# Altium project UZ_CarrierBoard.PrjPcb (part 5 of 10)

## Sheet J3-3xGTHCLK+1xPLLCLK+MIO+B47+B48.SchDoc
size A4; Author: AG / EA / MG; CompanyName: Technische Hochschule Nürnberg Georg Simon Ohm; Organization: UltraZohm; Address1: Kesslerplatz 12; Address2: 90489 Nürnberg; Address3: GERMANY; SheetNumber: 6; Website: www.ultrazohm.com
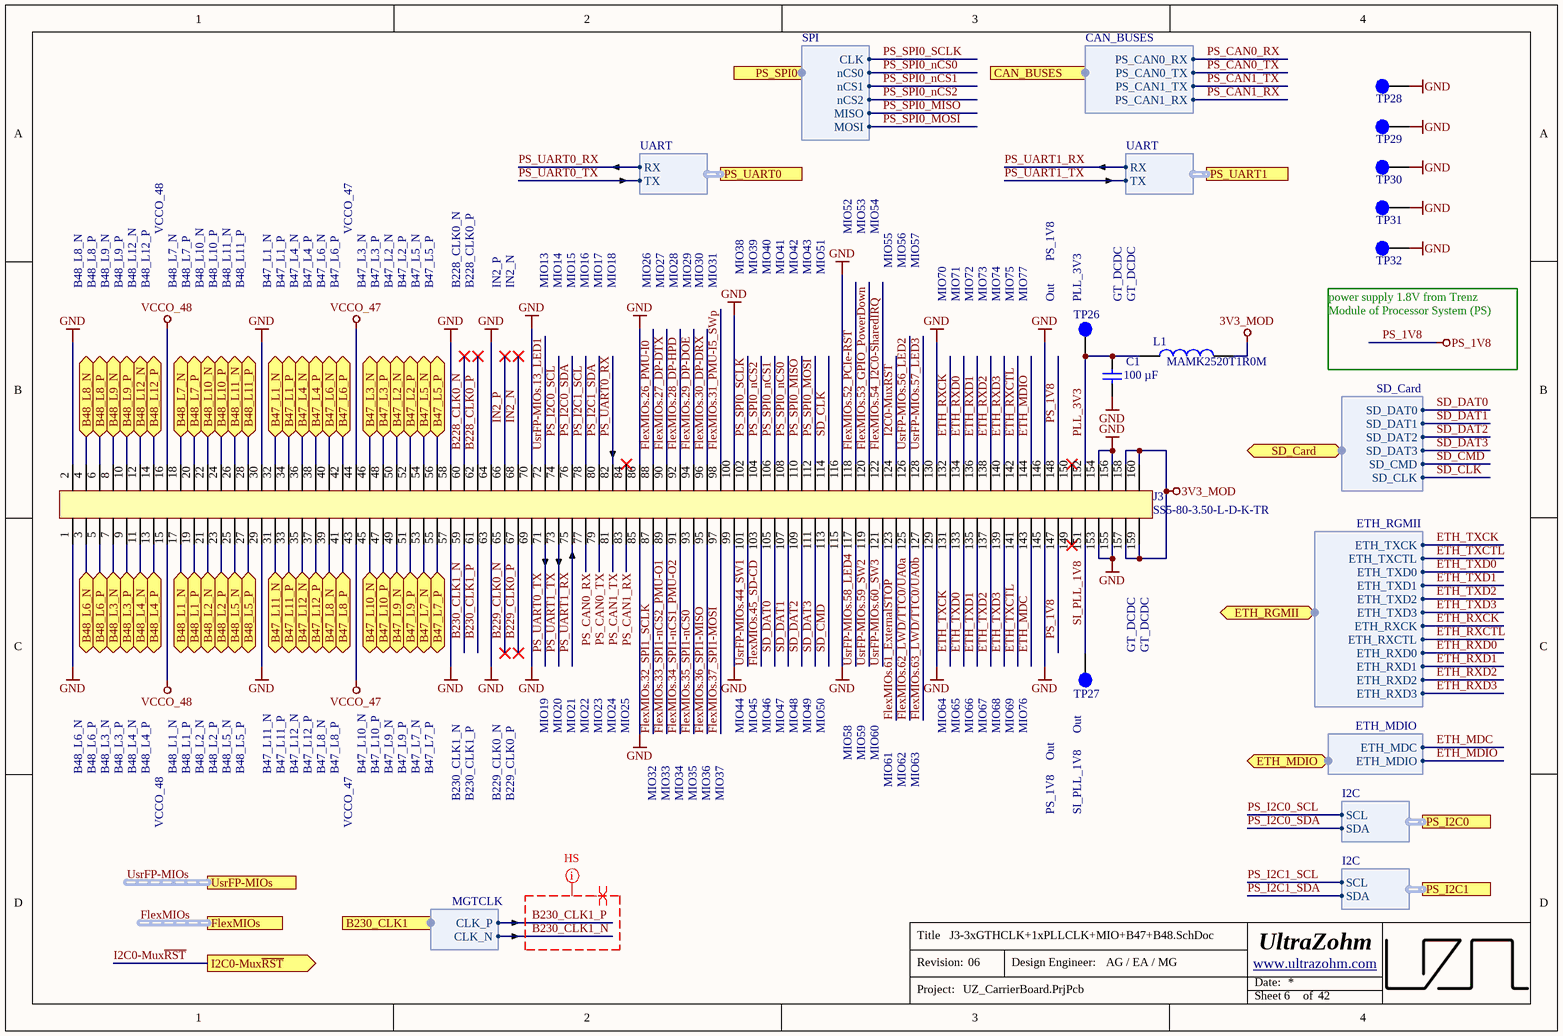
[diagram p13: J3-3xGTHCLK+1xPLLCLK+MIO+B47+B48.SchDoc]

### Parts
C1  100 µF  [C_1206_TE]
J3  SS5-80-3.50-L-D-K-TR  [SS5-80-3.50-L-D-K-TR]
L1  MAMK2520T1R0M  [INDC2520X120N]
TP26  Testpoint 1mm  [TP_1mm]  (value not drawn)  (no BOM)
TP27  Testpoint 1mm  [TP_1mm]  (value not drawn)  (no BOM)
TP28  Testpoint 1mm  [TP_1mm]  (value not drawn)  (no BOM)
TP29  Testpoint 1mm  [TP_1mm]  (value not drawn)  (no BOM)
TP30  Testpoint 1mm  [TP_1mm]  (value not drawn)  (no BOM)
TP31  Testpoint 1mm  [TP_1mm]  (value not drawn)  (no BOM)
TP32  Testpoint 1mm  [TP_1mm]  (value not drawn)  (no BOM)

### Ports
B47_L1_N (bidir), B47_L1_P (bidir), B47_L2_N (bidir), B47_L2_P (bidir), B47_L3_N (bidir), B47_L3_P (bidir), B47_L4_N (bidir), B47_L4_P (bidir), B47_L5_N (bidir), B47_L5_P (bidir), B47_L6_N (bidir), B47_L6_P (bidir), B47_L7_N (bidir), B47_L7_P (bidir), B47_L8_N (bidir), B47_L8_P (bidir), B47_L9_N (bidir), B47_L9_P (bidir), B47_L10_N (bidir), B47_L10_P (bidir), B47_L11_N (bidir), B47_L11_P (bidir), B47_L12_N (bidir), B47_L12_P (bidir), B48_L1_N (bidir), B48_L1_P (bidir), B48_L2_N (bidir), B48_L2_P (bidir), B48_L3_N (bidir), B48_L3_P (bidir), B48_L4_N (bidir), B48_L4_P (bidir), B48_L5_N (bidir), B48_L5_P (bidir), B48_L6_N (bidir), B48_L6_P (bidir), B48_L7_N (bidir), B48_L7_P (bidir), B48_L8_N (bidir), B48_L8_P (bidir), B48_L9_N (bidir), B48_L9_P (bidir), B48_L10_N (bidir), B48_L10_P (bidir), B48_L11_N (bidir), B48_L11_P (bidir), B48_L12_N (bidir), B48_L12_P (bidir), B230_CLK1 (harness MGTCLK), CAN_BUSES (harness CAN_BUSES), ETH_MDIO (bidir, harness ETH_MDIO), ETH_RGMII (bidir, harness ETH_RGMII), FlexMIOs (harness FlexMIOs), I2C0-Mux~{RST} (out), PS_I2C0 (harness I2C), PS_I2C1 (harness I2C), PS_SPI0 (harness SPI), PS_UART0 (harness UART), PS_UART1 (harness UART), SD_Card (bidir, harness SD_Card), UsrFP-MIOs (harness UsrFP-MIOs)

### Harnesses
ETH_RGMII: ETH_TXCK, ETH_TXCTL, ETH_TXD0, ETH_TXD1, ETH_TXD2, ETH_TXD3, ETH_RXCK, ETH_RXCTL, ETH_RXD0, ETH_RXD1, ETH_RXD2, ETH_RXD3
SD_Card: SD_DAT0, SD_DAT1, SD_DAT2, SD_DAT3, SD_CMD, SD_CLK
ETH_MDIO: ETH_MDC, ETH_MDIO
SPI: CLK, nCS0, MISO, MOSI, nCS1, nCS2
CAN_BUSES: PS_CAN0_RX, PS_CAN1_RX, PS_CAN1_TX, PS_CAN0_TX
I2C: SCL, SDA
UART: RX, TX
MGTCLK: CLK_N, CLK_P

### Nets
3V3_MOD: J3.157 J3.158 J3.159 J3.160 L1.2
GND: C1.2 J3.1 J3.2 J3.29 J3.30 J3.57 J3.58 J3.63 J3.64 J3.69 J3.70 J3.85 J3.86 J3.99 J3.100 J3.115 J3.116 J3.129 J3.130 J3.145 J3.146 J3.153 J3.154 J3.155 J3.156 TP28.1 TP29.1 TP30.1 TP31.1 TP32.1
PS_1V8: J3.147 J3.148
VCCO_47: J3.43 J3.44
VCCO_48: J3.15 J3.16
B228_CLK0_N: J3.60
B228_CLK0_P: J3.62
B229_CLK0_N: J3.65
B229_CLK0_P: J3.67
B230_CLK1_N: J3.59 ; port B230_CLK1.CLK_N
B230_CLK1_P: J3.61 ; port B230_CLK1.CLK_P
DIG_00_Ch4: J3.32 ; port B47_L1_N
DIG_01_Ch4: J3.31 ; port B47_L11_N
DIG_02_Ch4: J3.28 ; port B48_L11_P
DIG_03_Ch4: J3.27 ; port B48_L5_P
DIG_04_Ch4: J3.26 ; port B48_L11_N
DIG_05_Ch4: J3.25 ; port B48_L5_N
DIG_06_Ch4: J3.24 ; port B48_L10_P
DIG_07_Ch4: J3.23 ; port B48_L2_P
DIG_08_Ch4: J3.22 ; port B48_L10_N
DIG_08_Ch5: J3.56 ; port B47_L5_P
DIG_09_Ch4: J3.21 ; port B48_L2_N
DIG_09_Ch5: J3.55 ; port B47_L7_P
DIG_10_Ch4: J3.20 ; port B48_L7_P
DIG_10_Ch5: J3.54 ; port B47_L5_N
DIG_11_Ch4: J3.19 ; port B48_L1_P
DIG_11_Ch5: J3.53 ; port B47_L7_N
DIG_12_Ch4: J3.18 ; port B48_L7_N
DIG_12_Ch5: J3.52 ; port B47_L2_P
DIG_13_Ch4: J3.17 ; port B48_L1_N
DIG_13_Ch5: J3.51 ; port B47_L9_P
DIG_14_Ch4: J3.14 ; port B48_L12_P
DIG_14_Ch5: J3.50 ; port B47_L2_N
DIG_15_Ch4: J3.13 ; port B48_L4_P
DIG_15_Ch5: J3.49 ; port B47_L9_N
DIG_16_Ch4: J3.12 ; port B48_L12_N
DIG_16_Ch5: J3.48 ; port B47_L3_P
DIG_17_Ch4: J3.11 ; port B48_L4_N
DIG_17_Ch5: J3.47 ; port B47_L10_P
DIG_18_Ch4: J3.10 ; port B48_L9_P
DIG_18_Ch5: J3.46 ; port B47_L3_N
DIG_19_Ch4: J3.9 ; port B48_L3_P
DIG_19_Ch5: J3.45 ; port B47_L10_N
DIG_20_Ch4: J3.8 ; port B48_L9_N
DIG_20_Ch5: J3.42 ; port B47_L6_P
DIG_21_Ch4: J3.7 ; port B48_L3_N
DIG_21_Ch5: J3.41 ; port B47_L8_P
DIG_22_Ch4: J3.6 ; port B48_L8_P
DIG_22_Ch5: J3.40 ; port B47_L6_N
DIG_23_Ch4: J3.5 ; port B48_L6_P
DIG_23_Ch5: J3.39 ; port B47_L8_N
DIG_24_Ch3: J3.4 ; port B48_L8_N
DIG_24_Ch4: J3.38 ; port B47_L4_P
DIG_25_Ch3: J3.3 ; port B48_L6_N
DIG_25_Ch4: J3.37 ; port B47_L12_P
DIG_26_Ch4: J3.36 ; port B47_L4_N
DIG_27_Ch4: J3.35 ; port B47_L12_N
DIG_28_Ch4: J3.34 ; port B47_L1_P
DIG_29_Ch4: J3.33 ; port B47_L11_P
ETH_MDC: J3.143 ; port ETH_MDIO.ETH_MDC
ETH_MDIO: J3.144 ; port ETH_MDIO.ETH_MDIO
ETH_RXCK: J3.132 ; port ETH_RGMII.ETH_RXCK
ETH_RXCTL: J3.142 ; port ETH_RGMII.ETH_RXCTL
ETH_RXD0: J3.134 ; port ETH_RGMII.ETH_RXD0
ETH_RXD1: J3.136 ; port ETH_RGMII.ETH_RXD1
ETH_RXD2: J3.138 ; port ETH_RGMII.ETH_RXD2
ETH_RXD3: J3.140 ; port ETH_RGMII.ETH_RXD3
ETH_TXCK: J3.131 ; port ETH_RGMII.ETH_TXCK
ETH_TXCTL: J3.141 ; port ETH_RGMII.ETH_TXCTL
ETH_TXD0: J3.133 ; port ETH_RGMII.ETH_TXD0
ETH_TXD1: J3.135 ; port ETH_RGMII.ETH_TXD1
ETH_TXD2: J3.137 ; port ETH_RGMII.ETH_TXD2
ETH_TXD3: J3.139 ; port ETH_RGMII.ETH_TXD3
FlexMIOs.26_PMU-I0: J3.88
FlexMIOs.27_DP-DTX: J3.90
FlexMIOs.28_DP-HPD: J3.92
FlexMIOs.29_DP-DOE: J3.94
FlexMIOs.30_DP-DRX: J3.96
FlexMIOs.31_PMU-I5_SWp: J3.98
FlexMIOs.32_SPI1_SCLK: J3.87
FlexMIOs.33_SPI1-nCS2_PMU-O1: J3.89
FlexMIOs.34_SPI1-nCS1_PMU-O2: J3.91
FlexMIOs.35_SPI1-nCS0: J3.93
FlexMIOs.36_SPI1-MISO: J3.95
FlexMIOs.37_SPI1-MOSI: J3.97
FlexMIOs.45_SD-CD: J3.103
FlexMIOs.52_PCIe-~{RST}: J3.118
FlexMIOs.53_GPIO_PowerDown: J3.120
FlexMIOs.54_I2C0-Shared~{IRQ}: J3.122
FlexMIOs.61_ExternalSTOP: J3.123
FlexMIOs.62_LWD/TTC0/UA0a: J3.125
FlexMIOs.63_LWD/TTC0/UA0b: J3.127
I2C0-Mux~{RST}: J3.124 ; port I2C0-Mux~{RST}
IN2_N: J3.68
IN2_P: J3.66
PLL_3V3: C1.1 J3.152 L1.1 TP26.1
PS_CAN0_RX: J3.77 ; port CAN_BUSES.PS_CAN0_RX
PS_CAN0_TX: J3.79 ; port CAN_BUSES.PS_CAN0_TX
PS_CAN1_RX: J3.83 ; port CAN_BUSES.PS_CAN1_RX
PS_CAN1_TX: J3.81 ; port CAN_BUSES.PS_CAN1_TX
PS_I2C0_SCL: J3.74 ; port PS_I2C0.SCL
PS_I2C0_SDA: J3.76 ; port PS_I2C0.SDA
PS_I2C1_SCL: J3.78 ; port PS_I2C1.SCL
PS_I2C1_SDA: J3.80 ; port PS_I2C1.SDA
PS_SPI0_MISO: J3.110 ; port PS_SPI0.MISO  [project net PS_SPI0.MISO]
PS_SPI0_MOSI: J3.112 ; port PS_SPI0.MOSI  [project net PS_SPI0.MOSI]
PS_SPI0_nCS0: J3.108 ; port PS_SPI0.nCS0  [project net PS_SPI0.nCS0]
PS_SPI0_nCS1: J3.106 ; port PS_SPI0.nCS1  [project net PS_SPI0.nCS1]
PS_SPI0_nCS2: J3.104 ; port PS_SPI0.nCS2  [project net PS_SPI0.nCS2]
PS_SPI0_SCLK: J3.102 ; port PS_SPI0.CLK  [project net PS_SPI0.CLK]
PS_UART0_RX: J3.82 ; port PS_UART0.RX
PS_UART0_TX: J3.71 ; port PS_UART0.TX
PS_UART1_RX: J3.75 ; port PS_UART1.RX
PS_UART1_TX: J3.73 ; port PS_UART1.TX
SD_CLK: J3.114 ; port SD_Card.SD_CLK
SD_CMD: J3.113 ; port SD_Card.SD_CMD
SD_DAT0: J3.105 ; port SD_Card.SD_DAT0
SD_DAT1: J3.107 ; port SD_Card.SD_DAT1
SD_DAT2: J3.109 ; port SD_Card.SD_DAT2
SD_DAT3: J3.111 ; port SD_Card.SD_DAT3
SI_PLL_1V8: J3.151 TP27.1
UsrFP-MIOs.13_LED1: J3.72
UsrFP-MIOs.44_SW1: J3.101
UsrFP-MIOs.56_LED2: J3.126
UsrFP-MIOs.57_LED3: J3.128
UsrFP-MIOs.58_LED4: J3.117
UsrFP-MIOs.59_SW2: J3.119
UsrFP-MIOs.60_SW3: J3.121

Not connected (* = marked no-connect by the designer): J3 84* 149* 150*

### Buses and harness runs
harness FlexMIOs = port FlexMIOs
harness UsrFP-MIOs = port UsrFP-MIOs

### Layout directives
differential pair: B230_CLK1_N, B230_CLK1_P
net class HS: B230_CLK1_N, B230_CLK1_P

### Notes on the sheet
- VCCO_48
- VCCO_47
- MIO52
- MIO53
- MIO54
- B48_L8_N
- B48_L8_P
- B48_L9_N
- B48_L9_P
- B48_L12_N
- B48_L12_P
- B48_L7_N
- B48_L7_P
- B48_L10_N
- B48_L10_P
- B48_L11_N
- B48_L11_P
- B47_L1_N
- B47_L1_P
- B47_L4_N
- B47_L4_P
- B47_L6_N
- B47_L6_P
- B47_L3_N
- B47_L3_P
- B47_L2_N
- B47_L2_P
- B47_L5_N
- B47_L5_P
- B228_CLK0_N
- B228_CLK0_P
- IN2_P
- IN2_N
- MIO13
- MIO14
- MIO15
- MIO16
- MIO17
- MIO18
- MIO26
- MIO27
- MIO28
- MIO29
- MIO30
- MIO31
- MIO38
- MIO39
- MIO40
- MIO41
- MIO42
- MIO43
- MIO51
- MIO55
- MIO56
- MIO57
- MIO70
- MIO71
- MIO72
- MIO73
- MIO74
- MIO75
- MIO77
- PS_1V8
- (near TP26) Out
- (near TP26) PLL_3V3
- (near TP26) GT_DCDC
- GT_DCDC
- (near TP32) power supply 1.8V from Trenz Module of Processor System (PS)
- (near TP27) GT_DCDC
- B48_L6_N
- B48_L6_P
- B48_L3_N
- B48_L3_P
- B48_L4_N
- B48_L4_P
- B48_L1_N
- B48_L1_P
- B48_L2_N
- B48_L2_P
- B48_L5_N
- B48_L5_P
- B47_L11_N
- B47_L11_P
- B47_L12_N
- B47_L12_P
- B47_L8_N
- B47_L8_P
- B47_L10_N
- B47_L10_P
- B47_L9_N
- B47_L9_P
- B47_L7_N
- B47_L7_P
- MIO19
- MIO20
- MIO21
- MIO22
- MIO23
- MIO24
- MIO25
- MIO44
- MIO45
- MIO46
- MIO47
- MIO48
- MIO49
- MIO50
- MIO58
- MIO59
- MIO60
- MIO61
- MIO62
- MIO63
- MIO64
- MIO65
- MIO66
- MIO67
- MIO68
- MIO69
- MIO76
- Out
- (near TP27) Out
- B230_CLK1_N
- B230_CLK1_P
- B229_CLK0_N
- B229_CLK0_P
- MIO32
- MIO33
- MIO34
- MIO35
- MIO36
- MIO37
- SI_PLL_1V8
- Title
- Revision:
- Design Engineer:
- Date:
- Project:
- Sheet
- of

### Library data of the parts
C1 = CL31A107MQHNNNE: 6.3V 100uF X5R ±20% 1206 Multilayer Ceramic Capacitors MLCC; Manufacturer: Samsung Electro-Mechanics; Created from: MGeier; Tolerance: 20%; Value: 100 µF; Manufacturer Part Number: CL31A107MQHNNNE; PartID: 152; Created On: 02/08/2024 16:00:00; ComponentLink1Description: Datasheet; ComponentLink1URL: https://wmsc.lcsc.com/wmsc/upload/file/pdf/v2/lcsc/2304140030_Samsung-Electro-Mechanics-CL31A107MQHNNNE_C15008.pdf; Component Type: Capacitor 1206; Device Package: 1206; Last Updated: 02/08/2024 16:00:00; Mounting Type: SMD; Operating Temperature: -55 - 85°C; Series: CL; Supplier 1: LCSC; Supplier Part Number 1: C15008; Type: Capacitor; Voltage Rating: 6.3 V; Live Cycle Status: 1; LCSC Part Number: C15008; Stock number: not stored
J3 = SS5-80-3.50-L-D-K-TR: 0.5 mm Ultra Fine Pitch Socket REF192552-01, 160 Pins; Manufacturer: SAMTEC; Created from: MGremer; Number of positions: 80; Manufacturer Part Number: SS5-80-3.50-L-D-K-TR; PartID: 27; Created On: 01/12/2020 18:14:32; ComponentLink1Description: Homepage; ComponentLink1URL: https://www.samtec.com/de/products/ss5-80-3.50-l-d-k-tr; Component Type: Samtec Connector; Device Package: Connector; Last Updated: 11/07/2024 09:43:54; Mounting Type: SMD; Supplier 1: SAMTEC; Supplier Part Number 1: SS5-80-3.50-L-D-K-TR; Type: Connector; Live Cycle Status: 1; Number of rows: 2; LCSC Part Number: C5292077; Stock number: not stored
L1 = MAMK2520T1R0M: 1uH @2MHz ±20%, 2.7A, 59mOhm, 5040; Manufacturer: Taiyo Yuden; MF: EPCOS / TDK; DCR: 320m; Rated Current: 0.85 A; Type: Inductance SMD; Created from: FRosner; Value: 1uH; MPN: B82464G4154M; Supplier 1: Mouser; Supplier Part Number 1: 963-MAMK2520T1R0M; Manufacturer Part Number: MAMK2520T1R0M; PartID: 23; Created On: 05/09/2024 10:52:30; ComponentLink1Description: Datasheet; ComponentLink1URL: https://www.mouser.de/datasheet/2/396/wound10_e-1396630.pdf; Component Type: SMD Power Inductor; Device Package: 1008 (2520 metric); Last Updated: 05/09/2024 12:46:26; Mounting Type: SMD; Operating Temperature: -40°C to +105°C; Series: MA; Supplier 2: LCSC; Supplier Part Number 2: C92924; DC current: 2.7 A; Live Cycle Status: 1; LCSC Part Number: C92924; Stock number: not stored
TP26-TP32 = 25063: AN: 25063; Mixed: SMT

## Sheet J4-B64+B65.SchDoc
size A4; Author: AG / EA / MG; CompanyName: Technische Hochschule Nürnberg Georg Simon Ohm; Organization: UltraZohm; Address1: Kesslerplatz 12; Address2: 90489 Nürnberg; Address3: GERMANY; SheetNumber: 7; Website: www.ultrazohm.com
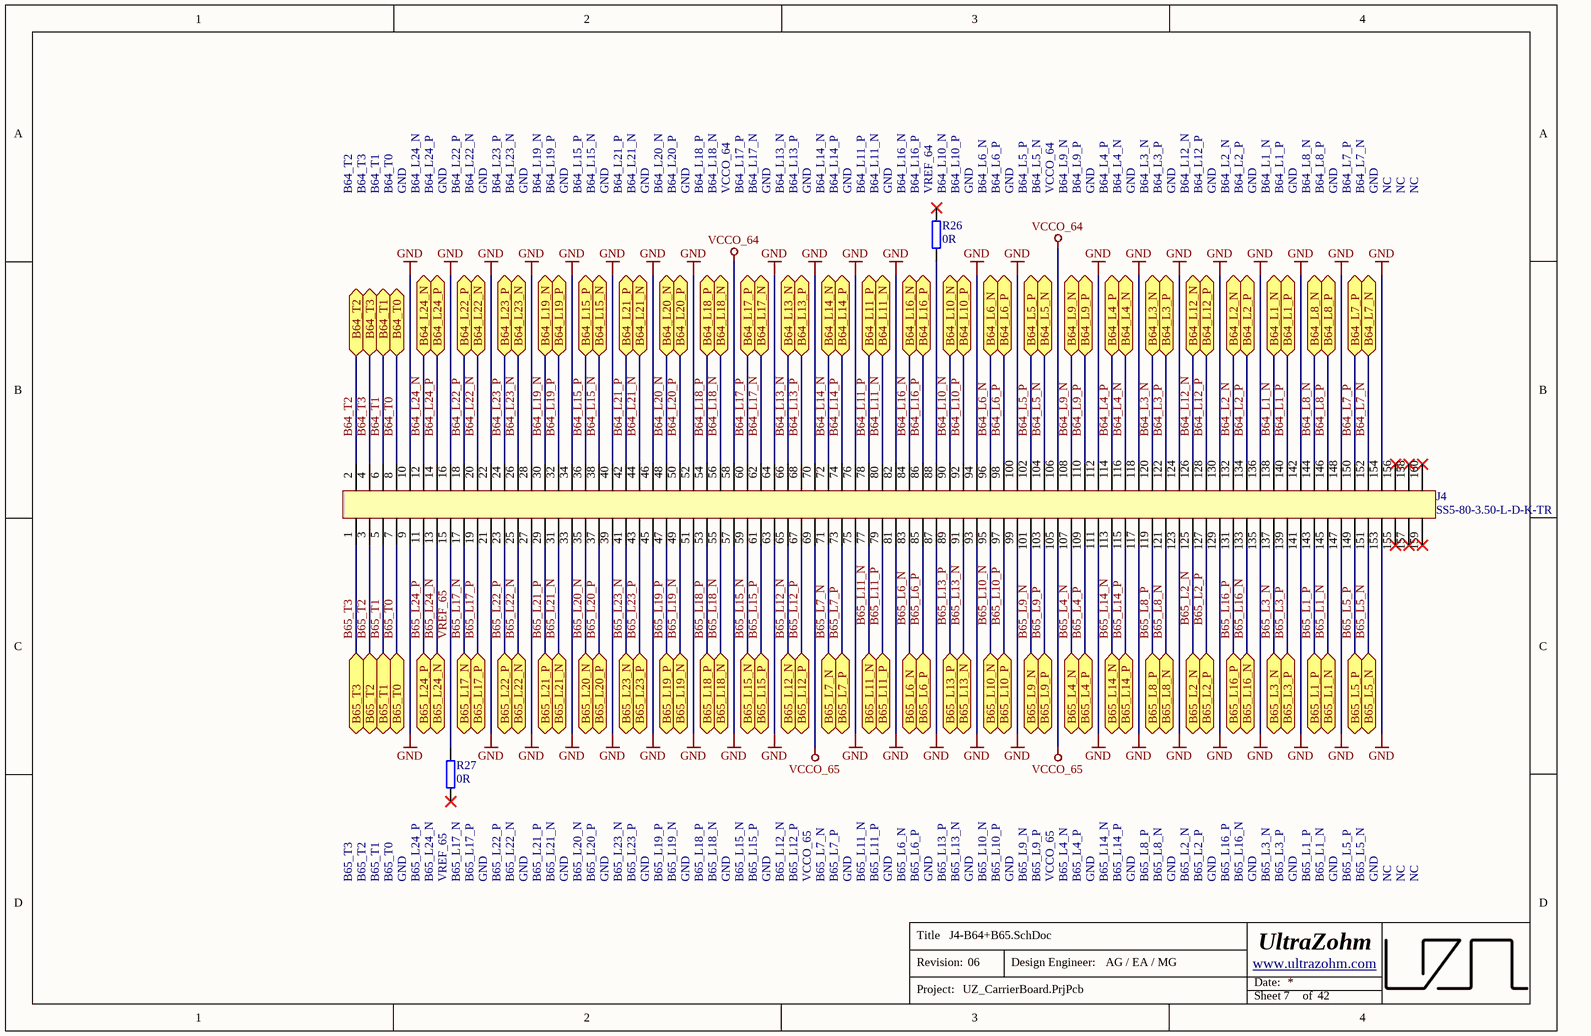
[diagram p14: J4-B64+B65.SchDoc]

### Parts
J4  SS5-80-3.50-L-D-K-TR  [SS5-80-3.50-L-D-K-TR]
R26  0R  [R_0603_TE]
R27  0R  [R_0603_TE]

### Ports
B64_L1_N (bidir), B64_L1_P (bidir), B64_L2_N (bidir), B64_L2_P (bidir), B64_L3_N (bidir), B64_L3_P (bidir), B64_L4_N (bidir), B64_L4_P (bidir), B64_L5_N (bidir), B64_L5_P (bidir), B64_L6_N (bidir), B64_L6_P (bidir), B64_L7_N (bidir), B64_L7_P (bidir), B64_L8_N (bidir), B64_L8_P (bidir), B64_L9_N (bidir), B64_L9_P (bidir), B64_L10_N (bidir), B64_L10_P (bidir), B64_L11_N (bidir), B64_L11_P (bidir), B64_L12_N (bidir), B64_L12_P (bidir), B64_L13_N (bidir), B64_L13_P (bidir), B64_L14_N (bidir), B64_L14_P (bidir), B64_L15_N (bidir), B64_L15_P (bidir), B64_L16_N (bidir), B64_L16_P (bidir), B64_L17_N (bidir), B64_L17_P (bidir), B64_L18_N (bidir), B64_L18_P (bidir), B64_L19_N (bidir), B64_L19_P (bidir), B64_L20_N (bidir), B64_L20_P (bidir), B64_L21_N (bidir), B64_L21_P (bidir), B64_L22_N (bidir), B64_L22_P (bidir), B64_L23_N (bidir), B64_L23_P (bidir), B64_L24_N (bidir), B64_L24_P (bidir), B64_T0 (bidir), B64_T1 (bidir), B64_T2 (bidir), B64_T3 (bidir), B65_L1_N (bidir), B65_L1_P (bidir), B65_L2_N (bidir), B65_L2_P (bidir), B65_L3_N (bidir), B65_L3_P (bidir), B65_L4_N (bidir), B65_L4_P (bidir), B65_L5_N (bidir), B65_L5_P (bidir), B65_L6_N (bidir), B65_L6_P (bidir), B65_L7_N (bidir), B65_L7_P (bidir), B65_L8_N (bidir), B65_L8_P (bidir), B65_L9_N (bidir), B65_L9_P (bidir), B65_L10_N (bidir), B65_L10_P (bidir), B65_L11_N (bidir), B65_L11_P (bidir), B65_L12_N (bidir), B65_L12_P (bidir), B65_L13_N (bidir), B65_L13_P (bidir), B65_L14_N (bidir), B65_L14_P (bidir), B65_L15_N (bidir), B65_L15_P (bidir), B65_L16_N (bidir), B65_L16_P (bidir), B65_L17_N (bidir), B65_L17_P (bidir), B65_L18_N (bidir), B65_L18_P (bidir), B65_L19_N (bidir), B65_L19_P (bidir), B65_L20_N (bidir), B65_L20_P (bidir), B65_L21_N (bidir), B65_L21_P (bidir), B65_L22_N (bidir), B65_L22_P (bidir), B65_L23_N (bidir), B65_L23_P (bidir), B65_L24_N (bidir), B65_L24_P (bidir), B65_T0 (bidir), B65_T1 (bidir), B65_T2 (bidir), B65_T3 (bidir)

### Nets
GND: J4.9 J4.10 J4.16 J4.21 J4.22 J4.27 J4.28 J4.33 J4.34 J4.39 J4.40 J4.45 J4.46 J4.51 J4.52 J4.57 J4.63 J4.64 J4.70 J4.75 J4.76 J4.81 J4.82 J4.87 J4.93 J4.94 J4.99 J4.100 J4.111 J4.112 J4.117 J4.118 J4.123 J4.124 J4.129 J4.130 J4.135 J4.136 J4.141 J4.142 J4.147 J4.148 J4.153 J4.154
VCCO_64: J4.58 J4.106
VCCO_65: J4.69 J4.105
B64_L1_N: J4.138 ; port B64_L1_N  [project net ANL_02_N]
B64_L1_P: J4.140 ; port B64_L1_P  [project net ANL_02_P]
B64_L2_N: J4.132 ; port B64_L2_N  [project net ANL_03_N]
B64_L2_P: J4.134 ; port B64_L2_P  [project net ANL_03_P]
B64_L3_N: J4.120 ; port B64_L3_N  [project net ANL_06_N]
B64_L3_P: J4.122 ; port B64_L3_P  [project net ANL_06_P]
B64_L4_N: J4.116 ; port B64_L4_N  [project net ANL_07_N]
B64_L4_P: J4.114 ; port B64_L4_P  [project net ANL_07_P]
B64_L5_N: J4.104 ; port B64_L5_N
B64_L5_P: J4.102 ; port B64_L5_P
B64_L6_N: J4.96 ; port B64_L6_N  [project net ANL_03_N]
B64_L6_P: J4.98 ; port B64_L6_P  [project net ANL_03_P]
B64_L7_N: J4.152 ; port B64_L7_N  [project net ANL_05_N]
B64_L7_P: J4.150 ; port B64_L7_P  [project net ANL_05_P]
B64_L8_N: J4.144 ; port B64_L8_N  [project net ANL_01_N]
B64_L8_P: J4.146 ; port B64_L8_P  [project net ANL_01_P]
B64_L9_N: J4.108 ; port B64_L9_N  [project net ANL_08_N]
B64_L9_P: J4.110 ; port B64_L9_P  [project net ANL_08_P]
B64_L10_N: J4.90 ; port B64_L10_N  [project net ANL_01_N]
B64_L10_P: J4.92 ; port B64_L10_P  [project net ANL_01_P]
B64_L11_N: J4.80 ; port B64_L11_N  [project net ANL_00_N]
B64_L11_P: J4.78 ; port B64_L11_P  [project net ANL_00_P]
B64_L12_N: J4.126 ; port B64_L12_N  [project net ANL_00_N]
B64_L12_P: J4.128 ; port B64_L12_P  [project net ANL_00_P]
B64_L13_N: J4.66 ; port B64_L13_N  [project net ANL_05_N]
B64_L13_P: J4.68 ; port B64_L13_P  [project net ANL_05_P]
B64_L14_N: J4.72 ; port B64_L14_N  [project net ANL_09_N]
B64_L14_P: J4.74 ; port B64_L14_P  [project net ANL_09_P]
B64_L15_N: J4.38 ; port B64_L15_N  [project net ANL_02_N]
B64_L15_P: J4.36 ; port B64_L15_P  [project net ANL_02_P]
B64_L16_N: J4.84 ; port B64_L16_N  [project net ANL_02_N]
B64_L16_P: J4.86 ; port B64_L16_P  [project net ANL_02_P]
B64_L17_N: J4.62 ; port B64_L17_N  [project net ANL_06_N]
B64_L17_P: J4.60 ; port B64_L17_P  [project net ANL_06_P]
B64_L18_N: J4.56 ; port B64_L18_N  [project net ANL_07_N]
B64_L18_P: J4.54 ; port B64_L18_P  [project net ANL_07_P]
B64_L19_N: J4.30 ; port B64_L19_N  [project net ANL_04_N]
B64_L19_P: J4.32 ; port B64_L19_P  [project net ANL_04_P]
B64_L20_N: J4.48 ; port B64_L20_N  [project net ANL_04_N]
B64_L20_P: J4.50 ; port B64_L20_P  [project net ANL_04_P]
B64_L21_N: J4.44 ; port B64_L21_N  [project net ANL_01_N]
B64_L21_P: J4.42 ; port B64_L21_P  [project net ANL_01_P]
B64_L22_N: J4.20 ; port B64_L22_N  [project net ANL_07_N]
B64_L22_P: J4.18 ; port B64_L22_P  [project net ANL_07_P]
B64_L23_N: J4.26 ; port B64_L23_N  [project net ANL_06_N]
B64_L23_P: J4.24 ; port B64_L23_P  [project net ANL_06_P]
B64_L24_N: J4.12 ; port B64_L24_N
B64_L24_P: J4.14 ; port B64_L24_P
B64_T0: J4.8 ; port B64_T0
B64_T1: J4.6 ; port B64_T1
B64_T2: J4.2 ; port B64_T2
B64_T3: J4.4 ; port B64_T3
B65_L1_N: J4.145 ; port B65_L1_N
B65_L1_P: J4.143 ; port B65_L1_P
B65_L2_N: J4.125 ; port B65_L2_N
B65_L2_P: J4.127 ; port B65_L2_P
B65_L3_N: J4.137 ; port B65_L3_N
B65_L3_P: J4.139 ; port B65_L3_P
B65_L4_N: J4.107 ; port B65_L4_N
B65_L4_P: J4.109 ; port B65_L4_P
B65_L5_N: J4.151 ; port B65_L5_N
B65_L5_P: J4.149 ; port B65_L5_P
B65_L6_N: J4.83 ; port B65_L6_N
B65_L6_P: J4.85 ; port B65_L6_P
B65_L7_N: J4.71 ; port B65_L7_N
B65_L7_P: J4.73 ; port B65_L7_P
B65_L8_N: J4.121 ; port B65_L8_N
B65_L8_P: J4.119 ; port B65_L8_P
B65_L9_N: J4.101 ; port B65_L9_N
B65_L9_P: J4.103 ; port B65_L9_P
B65_L10_N: J4.95 ; port B65_L10_N
B65_L10_P: J4.97 ; port B65_L10_P
B65_L11_N: J4.77 ; port B65_L11_N  [project net ANL_09_N]
B65_L11_P: J4.79 ; port B65_L11_P  [project net ANL_09_P]
B65_L12_N: J4.65 ; port B65_L12_N  [project net ANL_00_N]
B65_L12_P: J4.67 ; port B65_L12_P  [project net ANL_00_P]
B65_L13_N: J4.91 ; port B65_L13_N  [project net ANL_09_N]
B65_L13_P: J4.89 ; port B65_L13_P  [project net ANL_09_P]
B65_L14_N: J4.113 ; port B65_L14_N
B65_L14_P: J4.115 ; port B65_L14_P
B65_L15_N: J4.59 ; port B65_L15_N
B65_L15_P: J4.61 ; port B65_L15_P
B65_L16_N: J4.133 ; port B65_L16_N  [project net ANL_04_N]
B65_L16_P: J4.131 ; port B65_L16_P  [project net ANL_04_P]
B65_L17_N: J4.17 ; port B65_L17_N  [project net ANL_08_N]
B65_L17_P: J4.19 ; port B65_L17_P  [project net ANL_08_P]
B65_L18_N: J4.55 ; port B65_L18_N  [project net ANL_08_N]
B65_L18_P: J4.53 ; port B65_L18_P  [project net ANL_08_P]
B65_L19_N: J4.49 ; port B65_L19_N
B65_L19_P: J4.47 ; port B65_L19_P
B65_L20_N: J4.35 ; port B65_L20_N  [project net ANL_03_N]
B65_L20_P: J4.37 ; port B65_L20_P  [project net ANL_03_P]
B65_L21_N: J4.31 ; port B65_L21_N  [project net ANL_05_N]
B65_L21_P: J4.29 ; port B65_L21_P  [project net ANL_05_P]
B65_L22_N: J4.25 ; port B65_L22_N
B65_L22_P: J4.23 ; port B65_L22_P
B65_L23_N: J4.41 ; port B65_L23_N
B65_L23_P: J4.43 ; port B65_L23_P
B65_L24_N: J4.13 ; port B65_L24_N
B65_L24_P: J4.11 ; port B65_L24_P
B65_T0: J4.7 ; port B65_T0
B65_T1: J4.5 ; port B65_T1
B65_T2: J4.3 ; port B65_T2
B65_T3: J4.1 ; port B65_T3
VREF_65: J4.15 R27.2
NetJ4_88: J4.88 R26.1

Not connected (* = marked no-connect by the designer): J4 155* 156* 157* 158* 159* 160*; R26 2*; R27 1*

### Notes on the sheet
- B64_T2
- B64_T3
- B64_T1
- B64_T0
- GND
- B64_L24_N
- B64_L24_P
- B64_L22_P
- B64_L22_N
- B64_L23_P
- B64_L23_N
- B64_L19_N
- B64_L19_P
- B64_L15_P
- B64_L15_N
- B64_L21_P
- B64_L21_N
- B64_L20_N
- B64_L20_P
- B64_L18_P
- B64_L18_N
- VCCO_64
- B64_L17_P
- B64_L17_N
- B64_L13_N
- B64_L13_P
- B64_L14_N
- B64_L14_P
- B64_L11_P
- B64_L11_N
- (near R26) GND
- (near R26) B64_L16_N
- (near R26) B64_L16_P
- (near R26) VREF_64
- (near R26) B64_L10_N
- (near R26) B64_L10_P
- (near R26) B64_L6_N
- B64_L6_P
- B64_L5_P
- B64_L5_N
- B64_L9_N
- B64_L9_P
- B64_L4_P
- B64_L4_N
- B64_L3_N
- B64_L3_P
- B64_L12_N
- B64_L12_P
- B64_L2_N
- B64_L2_P
- B64_L1_N
- B64_L1_P
- B64_L8_N
- B64_L8_P
- B64_L7_P
- B64_L7_N
- NC
- B65_T3
- B65_T2
- B65_T1
- B65_T0
- (near R27) B65_L24_P
- (near R27) B65_L24_N
- (near R27) VREF_65
- (near R27) B65_L17_N
- (near R27) B65_L17_P
- B65_L22_P
- B65_L22_N
- B65_L21_P
- B65_L21_N
- B65_L20_N
- B65_L20_P
- B65_L23_N
- B65_L23_P
- B65_L19_P
- B65_L19_N
- B65_L18_P
- B65_L18_N
- B65_L15_N
- B65_L15_P
- B65_L12_N
- B65_L12_P
- VCCO_65
- B65_L7_N
- B65_L7_P
- B65_L11_N
- B65_L11_P
- B65_L6_N
- B65_L6_P
- B65_L13_P
- B65_L13_N
- B65_L10_N
- B65_L10_P
- B65_L9_N
- B65_L9_P
- B65_L4_N
- B65_L4_P
- B65_L14_N
- B65_L14_P
- B65_L8_P
- B65_L8_N
- B65_L2_N
- B65_L2_P
- B65_L16_P
- B65_L16_N
- B65_L3_N
- B65_L3_P
- B65_L1_P
- B65_L1_N
- B65_L5_P
- B65_L5_N
- Title
- Revision:
- Design Engineer:
- Date:
- Project:
- Sheet
- of

### Library data of the parts
J4 = SS5-80-3.50-L-D-K-TR: as J3 on sheet J3-3xGTHCLK+1xPLLCLK+MIO+B47+B48; Manufacturer Part Number: SS5-80-3.50-L-D-K-TR; PartID: 27; Created On: 01/12/2020 18:14:32; ComponentLink1Description: Homepage; ComponentLink1URL: https://www.samtec.com/de/products/ss5-80-3.50-l-d-k-tr; Component Type: Samtec Connector; Device Package: Connector; Last Updated: 11/07/2024 09:43:54; Mounting Type: SMD; Supplier 1: SAMTEC; Supplier Part Number 1: SS5-80-3.50-L-D-K-TR; Type: Connector; Live Cycle Status: 1; Number of rows: 2; Stock number: not stored; LCSC Part Number: C5292077
R26 R27 = UZgen_R_0603_0R: Generic resistor; Manufacturer: UZgen; Tolerance: 1 %; Created from: UZgenTool; Value: 0R; Manufacturer Part Number: UZgen_R_0603_0R; PartID: 581; Created On: 08.07.2024 14:34:30; Device Package: 0603; Mounting Type: SMD; Last Updated: 08.07.2024 14:34:30

## Sheet ETH-PHY.SchDoc
size A4; Author: AG / EA / MG; CompanyName: Technische Hochschule Nürnberg Georg Simon Ohm; Organization: UltraZohm; Address1: Kesslerplatz 12; Address2: 90489 Nürnberg; Address3: GERMANY; SheetNumber: 30; Website: www.ultrazohm.com
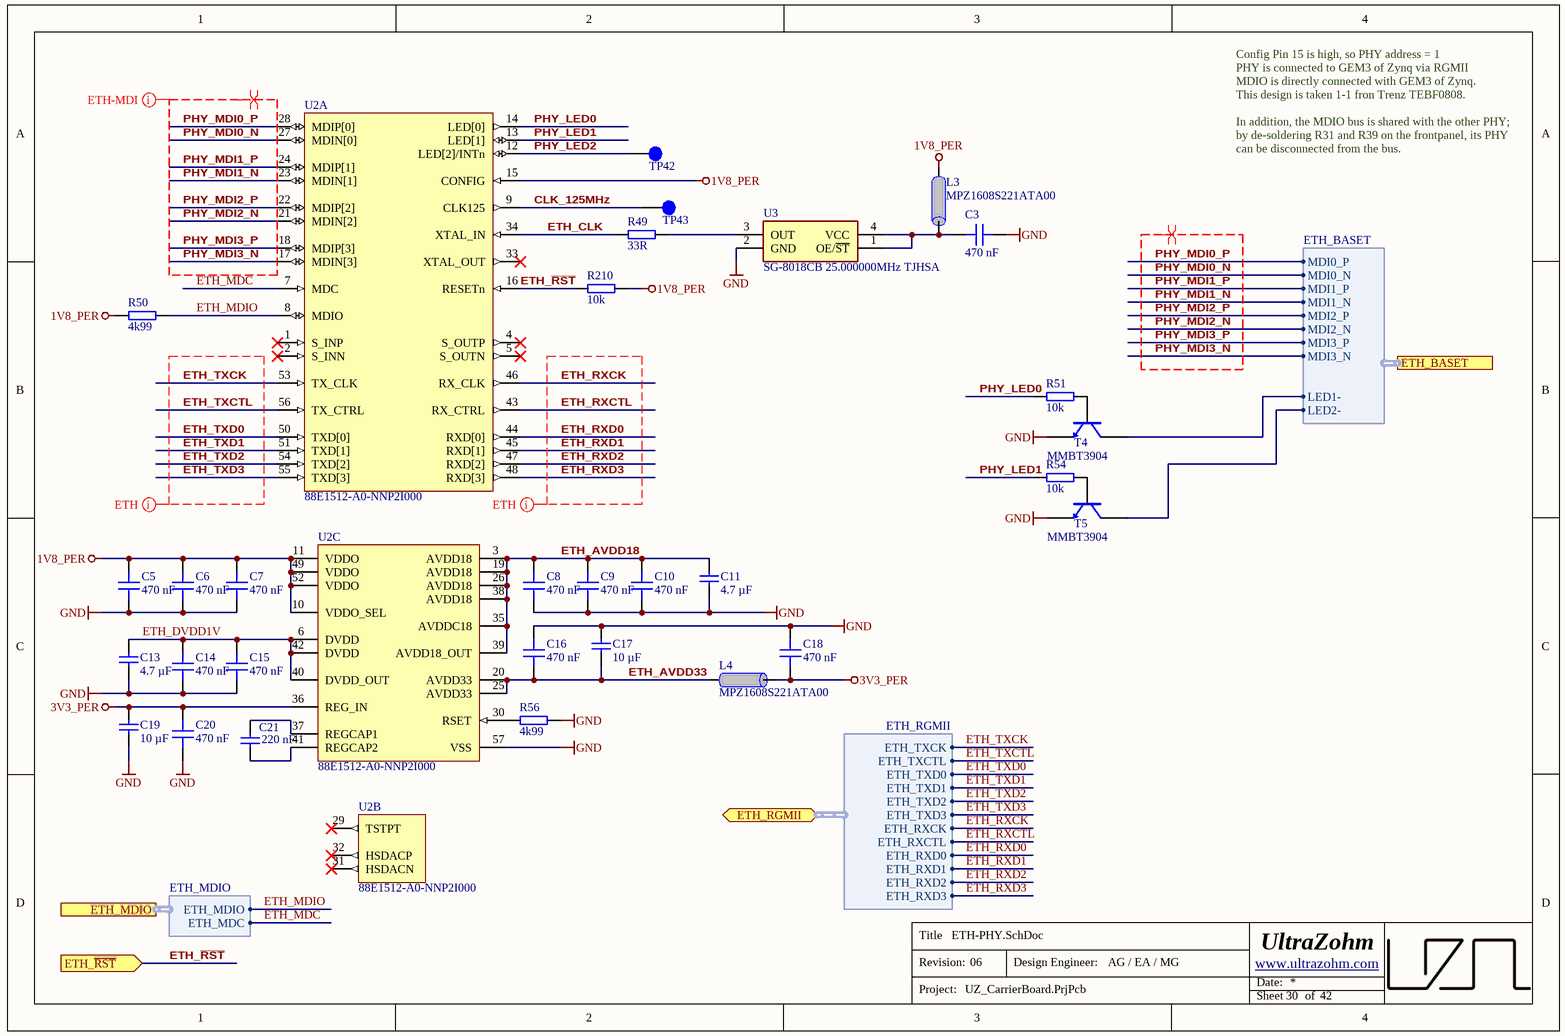
[diagram p15: ETH-PHY.SchDoc]

### Parts
C3  470 nF  [C_0603_TE]
C5  470 nF  [C_0603_TE]
C6  470 nF  [C_0603_TE]
C7  470 nF  [C_0603_TE]
C8  470 nF  [C_0603_TE]
C9  470 nF  [C_0603_TE]
C10  470 nF  [C_0603_TE]
C11  4.7 µF  [C_0603_TE]
C13  4.7 µF  [C_0603_TE]
C14  470 nF  [C_0603_TE]
C15  470 nF  [C_0603_TE]
C16  470 nF  [C_0603_TE]
C17  10 µF  [C_0603_TE]
C18  470 nF  [C_0603_TE]
C19  10 µF  [C_0603_TE]
C20  470 nF  [C_0603_TE]
C21  220 nF  [C_0603_TE]
L3  MPZ1608S221ATA00  [RES 0603_1608]
L4  MPZ1608S221ATA00  [RES 0603_1608]
R49  33R  [R_0603_TE]
R50  4k99  [RES 0603_1608]
R51  10k  [R_0603_TE]
R54  10k  [R_0603_TE]
R56  4k99  [RES 0603_1608]
R210  10k  [R_0603_TE]
T4  MMBT3904  [SOT95P280X145-3N]
T5  MMBT3904  [SOT95P280X145-3N]
TP42  Testpoint 1mm  [TP_1mm]  (value not drawn)  (no BOM)
TP43  Testpoint 1mm  [TP_1mm]  (value not drawn)  (no BOM)
U2  88E1512-A0-NNP2I000  [QFN50P800X800X100-57N]  (parts A,B,C of 3)
U3  SG-8018CB 25.000000MHz TJHSA  [SMD5032-4P]

### Ports
ETH_BASET (harness ETH_BASET), ETH_MDIO (harness ETH_MDIO), ETH_RGMII (bidir, harness ETH_RGMII), ETH_~{RST} (in)

### Harnesses
ETH_RGMII: ETH_TXCK, ETH_TXCTL, ETH_TXD0, ETH_TXD1, ETH_TXD2, ETH_TXD3, ETH_RXCK, ETH_RXCTL, ETH_RXD0, ETH_RXD1, ETH_RXD2, ETH_RXD3
ETH_MDIO: ETH_MDC, ETH_MDIO
ETH_BASET: MDI0_P, MDI0_N, MDI1_P, MDI1_N, MDI2_P, MDI2_N, MDI3_P, MDI3_N, LED1-, LED2-

### Nets
1V8_PER: C5.1 C6.1 C7.1 L3.1 R50.1 R210.2 U2.10(VDDO_SEL) U2.11(VDDO) U2.15(CONFIG) U2.49(VDDO) U2.52(VDDO)
3V3_PER: C18.2 C19.1 C20.1 L4.2 U2.36(REG_IN)
GND: C3.1 C5.2 C6.2 C7.2 C8.2 C9.2 C10.2 C11.2 C13.2 C14.2 C15.2 C16.1 C17.1 C18.1 C19.2 C20.2 R56.2 T4.2(EMITTER) T5.2(EMITTER) U2.57(VSS) U3.2(GND)
CLK_125MHz: TP43.1 U2.9(CLK125)
ETH_AVDD18: C8.1 C9.1 C10.1 C11.1 U2.3(AVDD18) U2.19(AVDD18) U2.26(AVDD18) U2.35(AVDDC18) U2.38(AVDD18) U2.39(AVDD18_OUT)
ETH_AVDD33: C16.2 C17.2 L4.1 U2.20(AVDD33) U2.25(AVDD33)
ETH_CLK: R49.1 U2.34(XTAL_IN)
ETH_DVDD1V: C13.1 C14.1 C15.1 U2.6(DVDD) U2.40(DVDD_OUT) U2.42(DVDD)
ETH_MDC: U2.7(MDC) ; port ETH_MDIO.ETH_MDC
ETH_MDIO: R50.2 U2.8(MDIO) ; port ETH_MDIO.ETH_MDIO
ETH_~{RST}: R210.1 U2.16(RESETn) ; port ETH_~{RST}  [project net Carrier_PG_1V8]
ETH_RXCK: U2.46(RX_CLK) ; port ETH_RGMII.ETH_RXCK
ETH_RXCTL: U2.43(RX_CTRL) ; port ETH_RGMII.ETH_RXCTL
ETH_RXD0: U2.44(RXD[0]) ; port ETH_RGMII.ETH_RXD0
ETH_RXD1: U2.45(RXD[1]) ; port ETH_RGMII.ETH_RXD1
ETH_RXD2: U2.47(RXD[2]) ; port ETH_RGMII.ETH_RXD2
ETH_RXD3: U2.48(RXD[3]) ; port ETH_RGMII.ETH_RXD3
ETH_TXCK: U2.53(TX_CLK) ; port ETH_RGMII.ETH_TXCK
ETH_TXCTL: U2.56(TX_CTRL) ; port ETH_RGMII.ETH_TXCTL
ETH_TXD0: U2.50(TXD[0]) ; port ETH_RGMII.ETH_TXD0
ETH_TXD1: U2.51(TXD[1]) ; port ETH_RGMII.ETH_TXD1
ETH_TXD2: U2.54(TXD[2]) ; port ETH_RGMII.ETH_TXD2
ETH_TXD3: U2.55(TXD[3]) ; port ETH_RGMII.ETH_TXD3
PHY_LED0: R51.1 U2.14(LED[0])
PHY_LED1: R54.1 U2.13(LED[1])
PHY_LED2: TP42.1 U2.12(LED[2]/INTn)
PHY_MDI0_N: U2.27(MDIN[0]) ; port ETH_BASET.MDI0_N
PHY_MDI0_P: U2.28(MDIP[0]) ; port ETH_BASET.MDI0_P
PHY_MDI1_N: U2.23(MDIN[1]) ; port ETH_BASET.MDI1_N
PHY_MDI1_P: U2.24(MDIP[1]) ; port ETH_BASET.MDI1_P
PHY_MDI2_N: U2.21(MDIN[2]) ; port ETH_BASET.MDI2_N
PHY_MDI2_P: U2.22(MDIP[2]) ; port ETH_BASET.MDI2_P
PHY_MDI3_N: U2.17(MDIN[3]) ; port ETH_BASET.MDI3_N
PHY_MDI3_P: U2.18(MDIP[3]) ; port ETH_BASET.MDI3_P
NetC3_2: C3.2 L3.2 U3.1(OE/~{ST}) U3.4(VCC)
NetC21_1: C21.1 U2.37(REGCAP1)
NetC21_2: C21.2 U2.41(REGCAP2)
NetR49_2: R49.2 U3.3(OUT)
NetR51_2: R51.2 T4.1(BASIS)
NetR54_2: R54.2 T5.1(BASIS)
NetR56_1: R56.1 U2.30(RSET)
NetT4_3: T4.3(COLLECTOR) ; port ETH_BASET.LED1-
NetT5_3: T5.3(COLLECTOR) ; port ETH_BASET.LED2-

Not connected (* = marked no-connect by the designer): U2 1(S_INP)* 2(S_INN)* 4(S_OUTP)* 5(S_OUTN)* 29(TSTPT)* 31(HSDACN)* 32(HSDACP)* 33(XTAL_OUT)*

### Layout directives
net class ETH: ETH_RXCK, ETH_RXCTL, ETH_RXD0, ETH_RXD1, ETH_RXD2, ETH_RXD3, ETH_TXCK, ETH_TXCTL, ETH_TXD0, ETH_TXD1, ETH_TXD2, ETH_TXD3
differential pair: PHY_MDI0_N, PHY_MDI0_P, PHY_MDI1_N, PHY_MDI1_P, PHY_MDI2_N, PHY_MDI2_P, PHY_MDI3_N, PHY_MDI3_P
net class ETH-MDI: PHY_MDI0_N, PHY_MDI0_P, PHY_MDI1_N, PHY_MDI1_P, PHY_MDI2_N, PHY_MDI2_P, PHY_MDI3_N, PHY_MDI3_P

### Notes on the sheet
- Config Pin 15 is high, so PHY address = 1
  PHY is connected to GEM3 of Zynq via RGMII
  MDIO is directly connected with GEM3 of Zynq.
  This design is taken 1-1 fron Trenz TEBF0808.
  In addition, the MDIO bus is shared with the other PHY; by de-soldering R31 and R39 on the frontpanel, its PHY can be disconnected from the bus.
- Title
- Revision:
- Design Engineer:
- Date:
- Project:
- Sheet
- of

### Library data of the parts
C3 C5-C10 C14-C16 C18 C20 = CL10A474KB8NNNC: Capacitor 0603, 50 VDC, 470 nF, X5R; Manufacturer: Samsung Electro-Mechanics; Tolerance: 10 %; Voltage Rating: 50 VDC; Created from: AGeiger; Value: 470 nF; Manufacturer Part Number: CL10A474KB8NNNC; PartID: 103; Created On: 22/08/2022 14:44:45; ComponentLink1Description: Datasheet; ComponentLink1URL: https://datasheet.lcsc.com/lcsc/1810191213_Samsung-Electro-Mechanics-CL10A474KB8NNNC_C170149.pdf; Component Type: Capacitor 0603; Device Package: 0603; Last Updated: 22/04/2025 15:48:45; Mounting Type: SMD; Operating Temperature: -55 - 85°C; Series: X5R; Supplier 1: LCSC; Supplier Part Number 1: C170149; Supplier 2: Mouser; Supplier Part Number 2: 187-CL10A474KB8NNNC; Type: Capacitor; Live Cycle Status: 1; LCSC Part Number: C170149
C11 C13 = UZgen_C_0603_4.7uF_16V_X5R: Generic capacitor; Manufacturer: UZgen; Tolerance: 10 %; Created from: MGeier; Voltage: 16V; Value: 4.7 µF; Manufacturer Part Number: UZgen_C_0603_4.7uF_16V_X5R; PartID: 5809; Created On: 20/03/2025 14:43:45; Device Package: 0603; Last Updated: 20/03/2025 14:43:45; Mounting Type: SMD; Technology: X5R
C17 C19 = UZgen_C_0603_10uF_6.3V_X7R: Generic capacitor; Manufacturer: UZgen; Tolerance: 10 %; Created from: UZgenTool; Voltage: 6.3V; Value: 10 µF; Manufacturer Part Number: UZgen_C_0603_10uF_6.3V_X7R; PartID: 3631; Created On: 02/08/2024 11:17:55; Device Package: 0603; Last Updated: 02/08/2024 11:17:55; Mounting Type: SMD; Technology: X7R
C21 = UZgen_C_0603_220nF_50V_X7R: Generic capacitor; Manufacturer: UZgen; Tolerance: 10 %; Voltage: 50V; Created from: UZgenTool; Value: 220 nF; Technology: X7R; Manufacturer Part Number: UZgen_C_0603_220nF_50V_X7R; PartID: 2; Created On: 02/07/2024 14:42:23; Device Package: 0603; Mounting Type: SMD; Last Updated: 08/08/2024 15:01:15
L3 L4 = MPZ1608S221ATA00: Ferritperle, 0603, 220 ohm, 2.2 A, Baureihe MPZ, 0.05 ohm, ± 25%; Manufacturer: TDK; Value: 220 Ohm; Type: Ferrite; DC current: 2.2 A; Created from: MGremer; Manufacturer Part Number: MPZ1608S221ATA00; PartID: 3; Created On: 08/06/2021 11:33:39; ComponentLink1Description: Datasheet; ComponentLink1URL: http://www.farnell.com/datasheets/2291439.pdf; Component Type: Ferritperle; Device Package: 0603; Last Updated: 12/07/2024 17:26:54; Mounting Type: SMD; Operating Temperature: -55 - 125 °C; Series: MPZ; Supplier 1: Farnell; Supplier Part Number 1: 1301677RL; Live Cycle Status: 1; LCSC Part Number: C76815; Stock number: not stored
R49 = UZgen_R_0603_33R: Generic resistor; Manufacturer: UZgen; Tolerance: 1 %; Created from: UZgenTool; Value: 33R; Manufacturer Part Number: UZgen_R_0603_33R; PartID: 185; Created On: 02/07/2024 17:29:48; Device Package: 0603; Mounting Type: SMD; Last Updated: 02/07/2024 17:29:48
R50 R56 = 0603WAF4991T5E: 1/10W Thick Film Resistors 75V ±1% ±100ppm/℃ -55℃~+155℃ 4.99kΩ 0603 Chip Resistor - Surface Mount ROHS; Manufacturer: UNI-ROYAL(Uniroyal Elec); Created from: NDiringer; Tolerance: 1%; Value: 4k99; Manufacturer Part Number: 0603WAF4991T5E; PartID: 230; Created On: 17/08/2022 08:08:34; ComponentLink1Description: Datasheet; ComponentLink1URL: https://datasheet.lcsc.com/lcsc/2206010116_UNI-ROYAL-Uniroyal-Elec-0603WAF4991T5E_C23046.pdf; Component Type: SMD resistor; Device Package: 0603; Last Updated: 17/08/2022 08:08:34; Mounting Type: SMD; Supplier 1: LCSC/JLCPCB; Supplier Part Number 1: C23046; Supplier 2: Mouser; Supplier Part Number 2: 303-0603WAF4991T5E; Type: Resistor; Live Cycle Status: 1; Stock number: not stored; LCSC Part Number: C23046
R51 R54 R210 = UZgen_R_0603_10k: Generic resistor; Manufacturer: UZgen; Tolerance: 1 %; Created from: AGeiger; Value: 10k; Manufacturer Part Number: UZgen_R_0603_10k; PartID: 1; Created On: 02/07/2024 14:34:53; Device Package: 0603; Mounting Type: SMD; Last Updated: 02/07/2024 14:37:16
T4 T5 = MMBT3904: Bipolartransistor, 40V 200mW 200mA 100@10mA,1V 300MHz 300mV@50mA,5mA NPN +150℃@(Tj) SOT-23(SOT-23-3); Manufacturer: Jiangsu Changjing Electronics Technology Co., Ltd.; Number Of Channels: single; Collector Basis Voltage: 60 V; Created from: NDiringer; Manufacturer Part Number: MMBT3904; PartID: 2; Created On: 10/06/2022 12:04:49; ComponentLink1Description: Datasheet; ComponentLink1URL: https://datasheet.lcsc.com/lcsc/1811011934_Jiangsu-Changjing-Electronics-Technology-Co---Ltd--MMBT3904_C20526.pdf; Component Type: Bipolartransistor; Device Package: SOT-23-3; Last Updated: 10/08/2022 13:48:16; Mounting Type: SMD; Operating Temperature: -55 - 150 °C; Series: MMBT3904; Supplier 1: Mouser; Supplier Part Number 1: MMBT3904; Supplier 2: LCSC/JLCPCB; Supplier Part Number 2: C20526; Type: Bipolartransistor; Collector Emitter Voltage: 40 V; Polarization: NPN; Power Dissipation: 200 mW; Value: 40 V; Live Cycle Status: 1; LCSC Part Number: C20526
TP42 TP43 = NULL: Manufacturer Part Number: NULL; Created from: AGeiger; Created: 2018_06_25_AGeiger; Value: Testpoint 1mm; PartID: 9; Created On: 20/09/2022 13:14:57; Component Type: Testpoint; Last Updated: 20/09/2022 13:15:39; Manufacturer: NULL; Supplier 1: NULL; Supplier Part Number 1: NULL; Type: Testpoint; Live Cycle Status: 1
U2 = 88E1512-A0-NNP2I000: Ethernet ICs Single-Port EEE GE PHY w/SGMII in 56-pin QFN; Manufacturer: Marvell; Created from: MGremer; Manufacturer Part Number: 88E1512-A0-NNP2I000; PartID: 1; Created On: 01/12/2020 16:21:41; ComponentLink1Description: Datasheet; ComponentLink1URL: https://www.mouser.de/datasheet/2/912/marvell-phys-transceivers-alaska-88e151x-datasheet-1360912.pdf; Component Type: Ethernet Single-Port; Device Package: QFN65; Last Updated: 26/06/2024 13:40:11; Mounting Type: SMD; Supplier 1: Mouser; Supplier Part Number 1: 348-88E1512A0NNP2I00; Type: Ethernet Single-Port; Live Cycle Status: 1; LCSC Part Number: C713256; Stock number: not stored
U3 = SG-8018CB 25.000000MHz TJHSA: ±50ppm 1.8V~3.3V 25MHz SMD5032-4P Programmable Oscillators ROHS; Manufacturer: Seiko Epson; Created from: FRosner; Value: 25 MHz; Manufacturer Part Number: SG-8018CB 25.000000MHz TJHSA; PartID: 3; Created On: 15/08/2024 10:38:39; ComponentLink1Description: Datasheet; ComponentLink1URL: https://download.epsondevice.com/td/pdf/app/SG-8018CB_en.pdf; Component Type: Oscillator; Device Package: 5032; Last Updated: 15/08/2024 10:38:39; Mounting Type: SMD; Operating Temperature: -40 to +105°C; Supplier 1: LCSC; Supplier Part Number 1: C390471; LCSC Part Number: C390471

## Sheet SD_Card.SchDoc
size A4; Author: AG / EA / MG; CompanyName: Technische Hochschule Nürnberg Georg Simon Ohm; Organization: UltraZohm; Address1: Kesslerplatz 12; Address2: 90489 Nürnberg; Address3: GERMANY; SheetNumber: 29; Website: www.ultrazohm.com
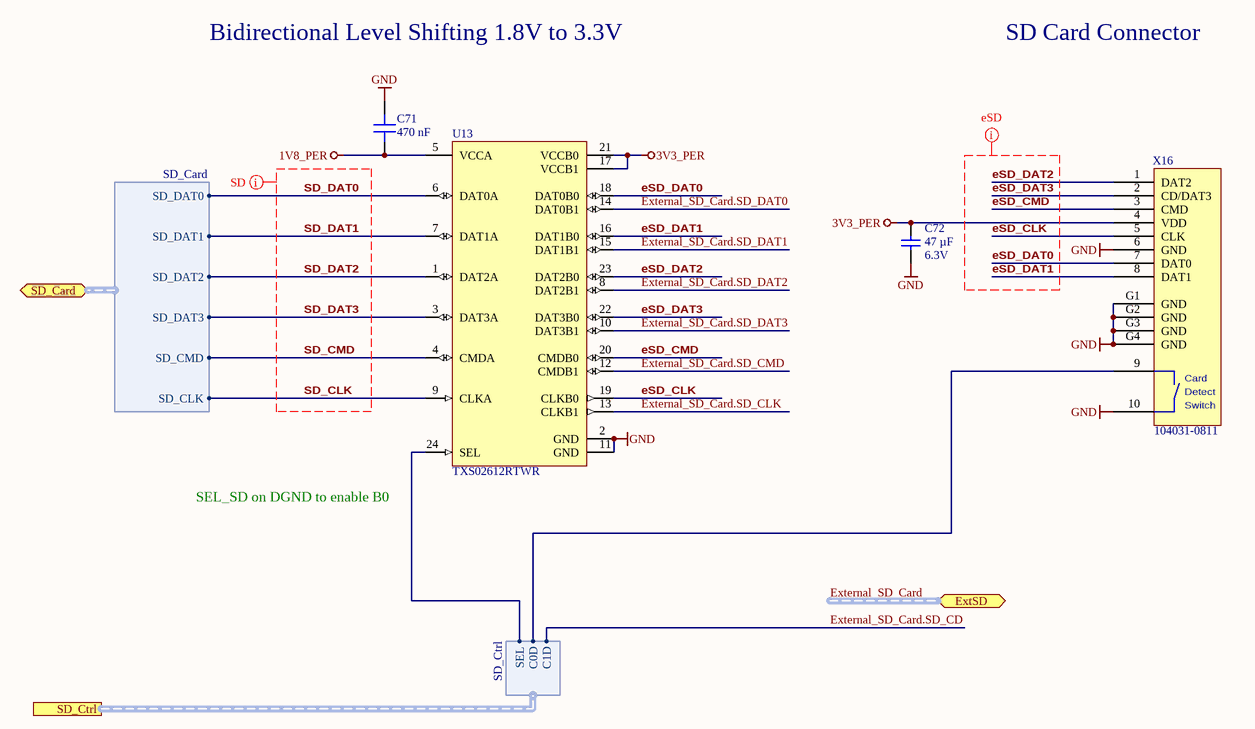
[diagram p16: SD_Card.SchDoc]

### Parts
C71  470 nF  [C_0603_TE]
C72  47 µF  Voltage: 6.3V  [C_0805_TE]
U13  TXS02612RTWR  [QFN50P400X400X80-25N-255]
X16  104031-0811  [104031-0811]

### Ports
ExtSD (bidir, harness ExtSD), SD_Card (bidir, harness SD_Card), SD_Ctrl (harness SD_CTRL)

### Harnesses
SD_Card: SD_DAT0, SD_DAT1, SD_DAT2, SD_DAT3, SD_CMD, SD_CLK
SD_Ctrl: SEL, C0D, C1D

### Nets
1V8_PER: C71.1 U13.5(VCCA)
3V3_PER: C72.2 U13.17(VCCB1) U13.21(VCCB0) X16.4(VDD)
GND: C71.2 C72.1 U13.2(GND) U13.11(GND) X16.6(GND) X16.10(CDSW) X16.G1(GND) X16.G2(GND) X16.G3(GND) X16.G4(GND)
eSD_CLK: U13.19(CLKB0) X16.5(CLK)
eSD_CMD: U13.20(CMDB0) X16.3(CMD)
eSD_DAT0: U13.18(DAT0B0) X16.7(DAT0)
eSD_DAT1: U13.16(DAT1B0) X16.8(DAT1)
eSD_DAT2: U13.23(DAT2B0) X16.1(DAT2)
eSD_DAT3: U13.22(DAT3B0) X16.2(CD/DAT3)
External_SD_Card.SD_CD: port SD_Ctrl.C1D
External_SD_Card.SD_CLK: U13.13(CLKB1)
External_SD_Card.SD_CMD: U13.12(CMDB1)
External_SD_Card.SD_DAT0: U13.14(DAT0B1)
External_SD_Card.SD_DAT1: U13.15(DAT1B1)
External_SD_Card.SD_DAT2: U13.8(DAT2B1)
External_SD_Card.SD_DAT3: U13.10(DAT3B1)
SD_CLK: U13.9(CLKA) ; port SD_Card.SD_CLK
SD_CMD: U13.4(CMDA) ; port SD_Card.SD_CMD
SD_Ctrl.C0D: X16.9(CDSW) ; port SD_Ctrl.C0D
SD_Ctrl.SEL: U13.24(SEL) ; port SD_Ctrl.SEL
SD_DAT0: U13.6(DAT0A) ; port SD_Card.SD_DAT0
SD_DAT1: U13.7(DAT1A) ; port SD_Card.SD_DAT1
SD_DAT2: U13.1(DAT2A) ; port SD_Card.SD_DAT2
SD_DAT3: U13.3(DAT3A) ; port SD_Card.SD_DAT3

### Buses and harness runs
harness External_SD_Card = port ExtSD

### Layout directives
net class eSD: eSD_CLK, eSD_CMD, eSD_DAT0, eSD_DAT1, eSD_DAT2, eSD_DAT3
net class SD: SD_CLK, SD_CMD, SD_DAT0, SD_DAT1, SD_DAT2, SD_DAT3

### Notes on the sheet
- Bidirectional Level Shifting 1.8V to 3.3V
- SD Card Connector
- SEL_SD on DGND to enable B0
- Title
- Revision:
- Design Engineer:
- Date:
- Project:
- Sheet
- of
- (in symbol 104031-0811) Card; Detect; Switch

### Library data of the parts
C71 = CL10A474KB8NNNC: Capacitor 0603, 50 VDC, 470 nF, X5R; Manufacturer: Samsung Electro-Mechanics; Tolerance: 10 %; Created from: AGeiger; Voltage Rating: 50 VDC; Value: 470 nF; Manufacturer Part Number: CL10A474KB8NNNC; PartID: 103; Created On: 22/08/2022 14:44:45; Device Package: 0603; Mounting Type: SMD; Last Updated: 22/04/2025 15:48:45; ComponentLink1Description: Datasheet; ComponentLink1URL: https://datasheet.lcsc.com/lcsc/1810191213_Samsung-Electro-Mechanics-CL10A474KB8NNNC_C170149.pdf; Component Type: Capacitor 0603; Operating Temperature: -55 - 85°C; Series: X5R; Supplier 1: LCSC; Supplier Part Number 1: C170149; Supplier 2: Mouser; Supplier Part Number 2: 187-CL10A474KB8NNNC; Type: Capacitor; Live Cycle Status: 1; LCSC Part Number: C170149
C72 = UZgen_C_0805_47uF_6.3V_X7R: Generic capacitor; Manufacturer: UZgen; Tolerance: 10 %; Created from: UZgenTool; Value: 47 µF; Technology: X7R; Manufacturer Part Number: UZgen_C_0805_47uF_6.3V_X7R; PartID: 5223; Created On: 02/08/2024 11:18:30; Device Package: 0805; Mounting Type: SMD; Last Updated: 02/08/2024 11:18:30
U13 = TXS02612RTWR: SDIO Port Expander with voltage level Translation; Manufacturer: Texas Instruments; Created from: MGremer; Manufacturer Part Number: TXS02612RTWR; PartID: 2; Created On: 01/12/2020 16:10:37; ComponentLink1Description: Datasheet; ComponentLink1URL: https://www.ti.com/lit/ds/sces682c/sces682c.pdf?ts=1606759646974&ref_url=https%253A%252F%252Fwww.google.com%252F; Component Type: Port Expander; Device Package: QFN; Last Updated: 04/09/2024 15:51:15; Mounting Type: QFN24; Supplier 1: Farnell; Supplier Part Number 1: 2335617RL; Supplier 2: Mouser; Supplier Part Number 2: 595-TXS02612RTWR; Supplier 3: Digi-Key; Supplier Part Number 3: 296-23869-1-ND; Type: Port Expander; Live Cycle Status: 1; Stock number: not stored; Supplier 4: LCSC; Supplier Part Number 4: C140276; LCSC Part Number: C140276
X16 = 104031-0811: microSD Memory Card Connector with detect switch; Manufacturer: Molex; Created from: MGremer; Manufacturer Part Number: 104031-0811; PartID: 1; Created On: 30/11/2020 14:53:05; ComponentLink1Description: Homepage; ComponentLink1URL: https://www.molex.com/molex/products/part-detail/memory_card_socket/1040310811; Component Type: SD Card Connector; Device Package: mircoSD; Last Updated: 09/07/2024 09:00:58; Mounting Type: SMD; Supplier 1: Farnell; Supplier Part Number 1: 2466891; Supplier 2: Mouser; Supplier Part Number 2: 538-104031-0811; Supplier 3: Digi-Key; Supplier Part Number 3: WM6357CT-ND; Supplier 4: LCSC; Supplier Part Number 4: C585350; Type: SD Card Connector; Live Cycle Status: 1; LCSC Part Number: C585350; Stock number: not stored

## Sheet User_Connectors.SchDoc
size A4; Author: AG / EA / MG; CompanyName: Technische Hochschule Nürnberg Georg Simon Ohm; Organization: UltraZohm; Address1: Kesslerplatz 12; Address2: 90489 Nürnberg; Address3: GERMANY; SheetNumber: 31; Website: www.ultrazohm.com
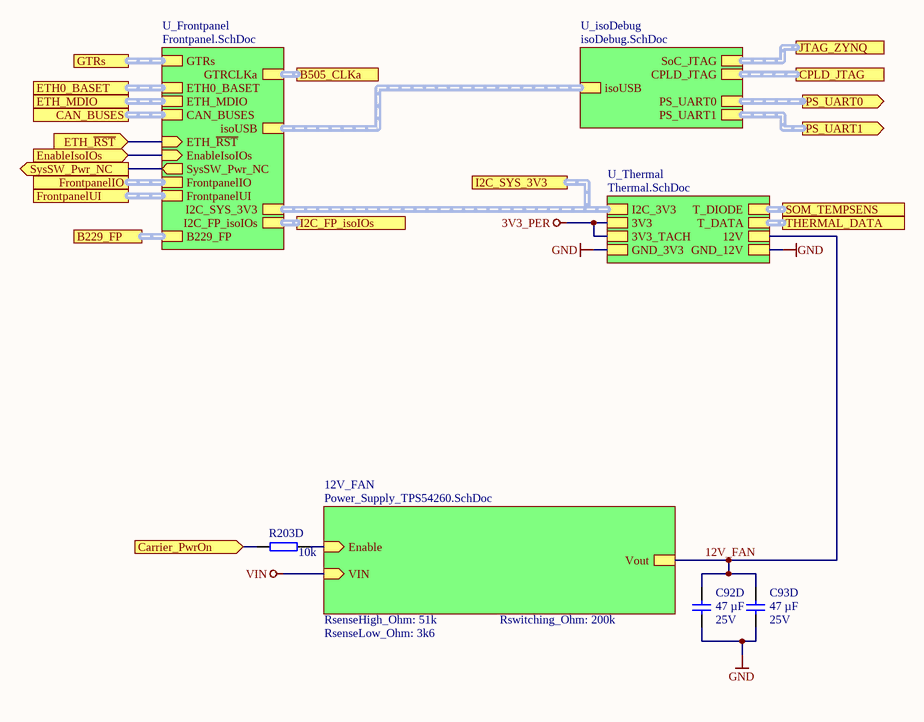
[diagram p17: User_Connectors.SchDoc]

### Parts
C92D  47 µF  Voltage: 25V  [C_1206_TE]
C93D  47 µF  Voltage: 25V  [C_1206_TE]
R203D  10k  [R_0603_TE]

### Sub-sheets
12V_FAN = Power_Supply_TPS54260.SchDoc: Vout, Enable (in), VIN (in)  | RsenseHigh_Ohm: 51k; RsenseLow_Ohm: 3k6; Rswitching_Ohm: 200k; SubSheet_SheetNumber: 37; Output_V: 12
U_Frontpanel = Frontpanel.SchDoc: GTRs (harness GTRs), ETH0_BASET (harness ETH_BASET), ETH_MDIO (harness ETH_MDIO), isoUSB (harness USB), I2C_SYS_3V3 (harness I2C), FrontpanelUI (harness FrontpanelUI), SysSW_Pwr_NC (out), GTRCLKa (harness MGTCLK), CAN_BUSES (harness CAN_BUSES), FrontpanelIO (harness FrontpanelIO), ETH_~{RST} (in), EnableIsoIOs (in), I2C_FP_isoIOs (harness I2C), B229_FP (harness GTH)
U_isoDebug = isoDebug.SchDoc: SoC_JTAG (harness JTAG), CPLD_JTAG (harness JTAG), PS_UART0 (harness UART), PS_UART1 (harness UART), isoUSB (harness USB)  | SubSheet_SheetNumber: 33
U_Thermal = Thermal.SchDoc: I2C_3V3 (harness I2C), T_DIODE (harness T_DIODE), T_DATA (harness T_DATA), 12V, 3V3, 3V3_TACH, GND_3V3, GND_12V  | SubSheet_SheetNumber: 36

### Ports
B229_FP (harness GTH), B505_CLKa (harness MGTCLK), CAN_BUSES (harness CAN_BUSES), Carrier_PwrOn (in), CPLD_JTAG (harness JTAG), EnableIsoIOs (in), ETH0_BASET (harness ETH_BASET), ETH_MDIO (harness ETH_MDIO), ETH_~{RST} (in), FrontpanelIO (harness FrontpanelIO), FrontpanelUI (harness FrontpanelUI), GTRs (harness GTRs), I2C_FP_isoIOs (harness I2C), I2C_SYS_3V3 (harness I2C), JTAG_ZYNQ (harness JTAG), PS_UART0 (out, harness UART), PS_UART1 (out, harness UART), SOM_TEMPSENS (harness T_DIODE), SysSW_Pwr_NC (out), THERMAL_DATA (harness T_DATA)

### Nets
3V3_PER: sheet U_Thermal/3V3, sheet U_Thermal/3V3_TACH
GND: C92D.1 C93D.1 ; sheet U_Thermal/GND_3V3, sheet U_Thermal/GND_12V
12V_FAN: C92D.2 C93D.2 ; sheet U_Thermal/12V, sheet 12V_FAN/Vout
Carrier_PG_1V8: port ETH_~{RST}, sheet U_Frontpanel/ETH_~{RST}
Carrier_PG_3V3: port EnableIsoIOs, sheet U_Frontpanel/EnableIsoIOs
Carrier_PwrOn: R203D.1 ; port Carrier_PwrOn
Enable: R203D.2 ; sheet 12V_FAN/Enable
SysSW_Pwr_NC: port SysSW_Pwr_NC, sheet U_Frontpanel/SysSW_Pwr_NC

### Buses and harness runs
harness port B229_FP = sheet U_Frontpanel/B229_FP
harness port B505_CLKa = sheet U_Frontpanel/GTRCLKa
harness port CAN_BUSES = sheet U_Frontpanel/CAN_BUSES
harness port CPLD_JTAG = sheet U_isoDebug/CPLD_JTAG
harness port ETH0_BASET = sheet U_Frontpanel/ETH0_BASET
harness port ETH_MDIO = sheet U_Frontpanel/ETH_MDIO
harness port FrontpanelIO = sheet U_Frontpanel/FrontpanelIO
harness port FrontpanelUI = sheet U_Frontpanel/FrontpanelUI
harness port GTRs = sheet U_Frontpanel/GTRs
harness port I2C_FP_isoIOs = sheet U_Frontpanel/I2C_FP_isoIOs
harness port I2C_SYS_3V3 = sheet U_Frontpanel/I2C_SYS_3V3 = sheet U_Thermal/I2C_3V3
harness port JTAG_ZYNQ = sheet U_isoDebug/SoC_JTAG
harness port PS_UART0 = sheet U_isoDebug/PS_UART0
harness port PS_UART1 = sheet U_isoDebug/PS_UART1
harness port SOM_TEMPSENS = sheet U_Thermal/T_DIODE
harness port THERMAL_DATA = sheet U_Thermal/T_DATA
harness sheet U_Frontpanel/isoUSB = sheet U_isoDebug/isoUSB

### Notes on the sheet
- Title
- Revision:
- Design Engineer:
- Date:
- Project:
- Sheet
- of

### Library data of the parts
C92D C93D = UZgen_C_1206_47uF_25V_X7R: Generic capacitor; Manufacturer: UZgen; Tolerance: 10 %; Created from: UZgenTool; Value: 47 µF; Technology: X7R; Manufacturer Part Number: UZgen_C_1206_47uF_25V_X7R; PartID: 5224; Created On: 02/08/2024 11:18:30; Device Package: 1206; Mounting Type: SMD; Last Updated: 02/08/2024 11:18:30
R203D = UZgen_R_0603_10k: as R51 on sheet ETH-PHY; Value: 10k; Manufacturer Part Number: UZgen_R_0603_10k; PartID: 1; Created On: 02.07.2024 14:34:53; Device Package: 0603; Mounting Type: SMD; Last Updated: 02.07.2024 14:37:16

## Sheet isoDebug.SchDoc
size A4; Organization: UltraZohm; SheetNumber: 31; SheetTotal: 40
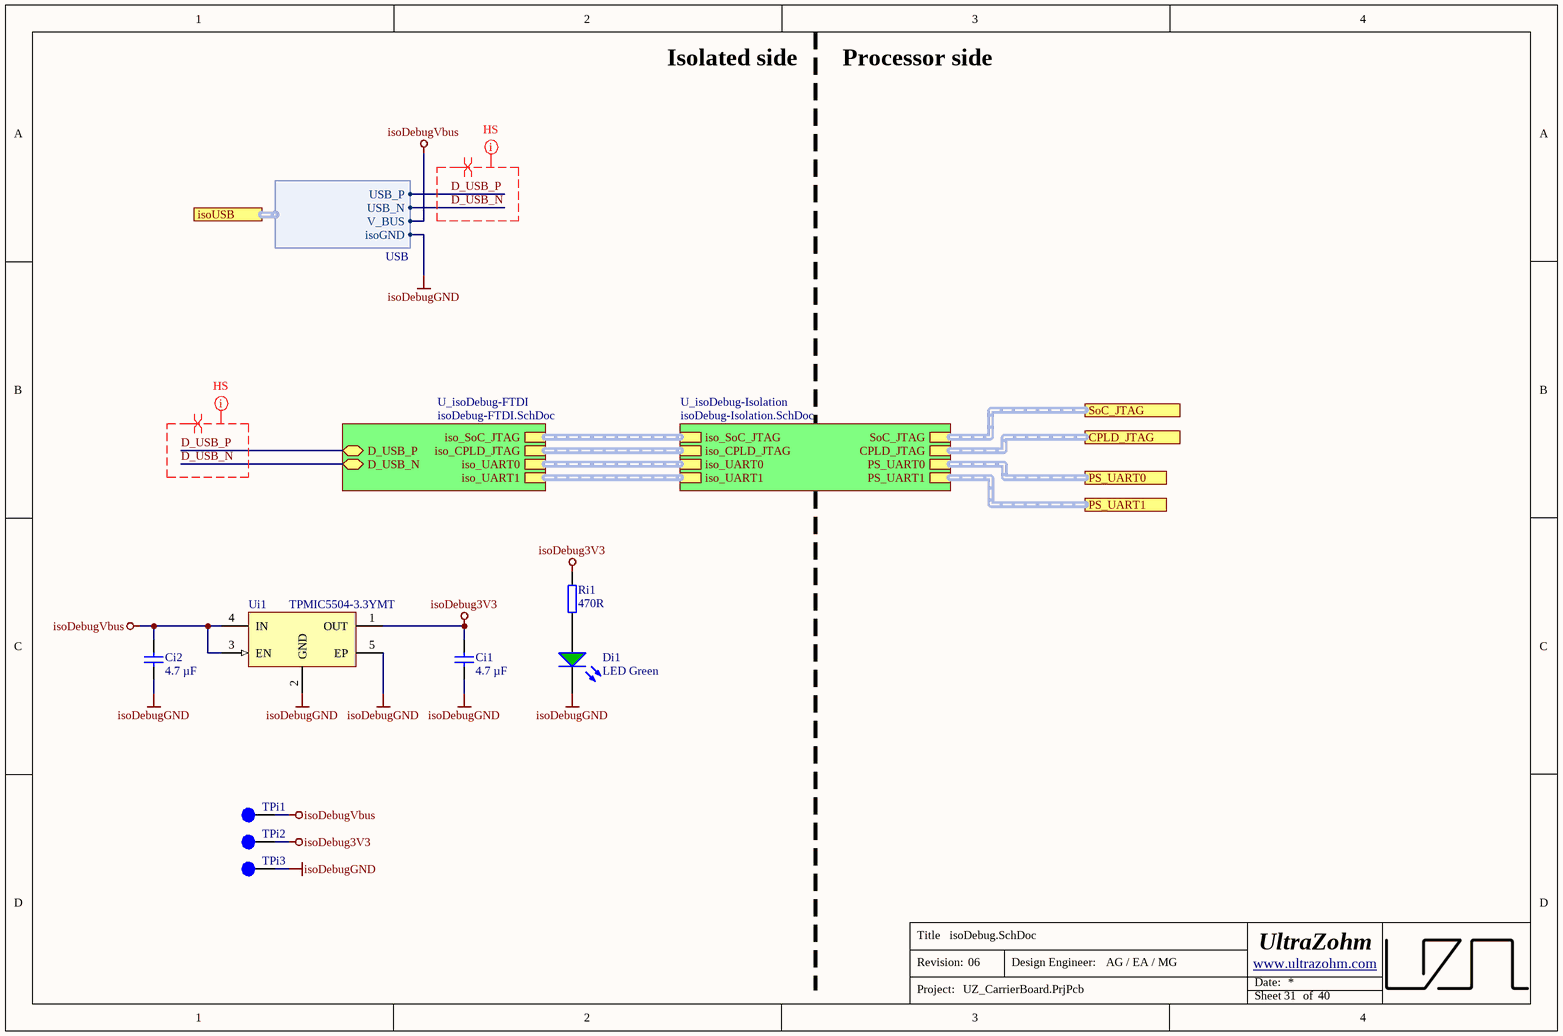
[diagram p18: isoDebug.SchDoc]

### Parts
Ci1  4.7 µF  [C_0603_TE]
Ci2  4.7 µF  [C_0603_TE]
Di1  LED Green  [WL-SMCW_0603]
Ri1  470R  [R_0603_TE]
TPi1  Testpoint 1mm  [TP_1mm]  (value not drawn)  (no BOM)
TPi2  Testpoint 1mm  [TP_1mm]  (value not drawn)  (no BOM)
TPi3  Testpoint 1mm  [TP_1mm]  (value not drawn)  (no BOM)
Ui1  TPMIC5504-3.3YMT  [DFN-4-EP]

### Sub-sheets
U_isoDebug-FTDI = isoDebug-FTDI.SchDoc: iso_SoC_JTAG (harness JTAG), iso_CPLD_JTAG (harness JTAG), iso_UART0 (harness UART), iso_UART1 (harness UART), D_USB_P (bidir), D_USB_N (bidir)
U_isoDebug-Isolation = isoDebug-Isolation.SchDoc: iso_SoC_JTAG (harness JTAG), iso_CPLD_JTAG (harness JTAG), iso_UART0 (harness UART), iso_UART1 (harness UART), SoC_JTAG (harness JTAG), CPLD_JTAG (harness JTAG), PS_UART0 (harness UART), PS_UART1 (harness UART)

### Ports
CPLD_JTAG (harness JTAG), isoUSB (harness USB), PS_UART0 (harness UART), PS_UART1 (harness UART), SoC_JTAG (harness JTAG)

### Harnesses
USB: USB_P, USB_N, V_BUS, isoGND

### Nets
isoDebug3V3: Ci1.2 Ri1.2 TPi2.1 Ui1.1(OUT)
isoDebugGND: Ci1.1 Ci2.1 Di1.1(K) TPi3.1 Ui1.2(GND) Ui1.5(EP) ; port isoUSB.isoGND
isoDebugVbus: Ci2.2 TPi1.1 Ui1.3(EN) Ui1.4(IN) ; port isoUSB.V_BUS
D_USB_N: sheet U_isoDebug-FTDI/D_USB_N, port isoUSB.USB_N
D_USB_P: sheet U_isoDebug-FTDI/D_USB_P, port isoUSB.USB_P
NetDi1_2: Di1.2(A) Ri1.1

### Buses and harness runs
harness port CPLD_JTAG = sheet U_isoDebug-Isolation/CPLD_JTAG
harness port PS_UART0 = sheet U_isoDebug-Isolation/PS_UART0
harness port PS_UART1 = sheet U_isoDebug-Isolation/PS_UART1
harness port SoC_JTAG = sheet U_isoDebug-Isolation/SoC_JTAG
harness sheet U_isoDebug-FTDI/iso_CPLD_JTAG = sheet U_isoDebug-Isolation/iso_CPLD_JTAG
harness sheet U_isoDebug-FTDI/iso_SoC_JTAG = sheet U_isoDebug-Isolation/iso_SoC_JTAG
harness sheet U_isoDebug-FTDI/iso_UART0 = sheet U_isoDebug-Isolation/iso_UART0
harness sheet U_isoDebug-FTDI/iso_UART1 = sheet U_isoDebug-Isolation/iso_UART1

### Layout directives
differential pair: D_USB_N, D_USB_P
net class HS: D_USB_N, D_USB_P

### Notes on the sheet
- Isolated side
- Processor side
- Title
- Revision:
- Design Engineer:
- Date:
- Project:
- Sheet
- of

### Library data of the parts
Ci1 Ci2 = UZgen_C_0603_4.7uF_16V_X5R: as C11 on sheet ETH-PHY; Manufacturer Part Number: UZgen_C_0603_4.7uF_16V_X5R; PartID: 5809; Created On: 20/03/2025 14:43:45; Device Package: 0603; Last Updated: 20/03/2025 14:43:45; Mounting Type: SMD; Value: 4.7 µF; Technology: X5R
Di1 = UZgen_LED_0603_Green: Standard LEDs - SMD 0603 green; Manufacturer: UZgen; Created from: UZgenTool; Manufacturer Part Number: UZgen_LED_0603_Green; PartID: 21; Created On: 09/09/2024 10:45:01; ComponentLink1Description: N/A; ComponentLink1URL: N/A; Component Type: LED Diode; Device Package: 0603; Last Updated: 09/09/2024 10:45:01; Mounting Type: SMD; Supplier 1: LCSC; Supplier Part Number 1: =LCSC Part Number; Type: Standard; Live Cycle Status: 1; Stock number: not stored; Color: green; Value: LED Green
Ri1 = UZgen_R_0603_470R: Generic resistor; Manufacturer: UZgen; Tolerance: 1 %; Created from: UZgenTool; Manufacturer Part Number: UZgen_R_0603_470R; PartID: 213; Created On: 02/07/2024 17:29:49; Device Package: 0603; Last Updated: 02/07/2024 17:29:49; Mounting Type: SMD; Value: 470R
TPi1-TPi3 = NULL: as TP42 on sheet ETH-PHY; Created: 2018_06_25_AGeiger; Value: Testpoint 1mm; PartID: 9; Created On: 20.09.2022 13:14:57; Component Type: Testpoint; Last Updated: 20.09.2022 13:15:39; Manufacturer: NULL; Supplier 1: NULL; Supplier Part Number 1: NULL; Type: Testpoint; Live Cycle Status: 1
Ui1 = TPMIC5504-3.3YMT: DFN-4-EP(1x1) Linear Voltage Regulators (LDO) ROHS; Manufacturer: TECH PUBLIC; Value: 3.3 V; Created from: AGeiger; Manufacturer Part Number: TPMIC5504-3.3YMT; PartID: 15; Created On: 26.11.2023 13:32:42; ComponentLink1Description: Datasheet; ComponentLink1URL: https://datasheet.lcsc.com/lcsc/2205241716_TECH-PUBLIC-TPMIC5504-3-3YMT_C3021135.pdf; Component Type: LDO; Device Package: SMD; Last Updated: 26.11.2023 13:32:42; Mounting Type: SMD; Operating Temperature: -40 to 125 °C; Series: TPMIC5504; Supplier 1: LCSC; Supplier Part Number 1: C3021135; Type: LDO; Live Cycle Status: 1; LCSC Part Number: C3021135; Stock number: not stored